# EAGLE design bp_to_avr (EAGLE 6.3)
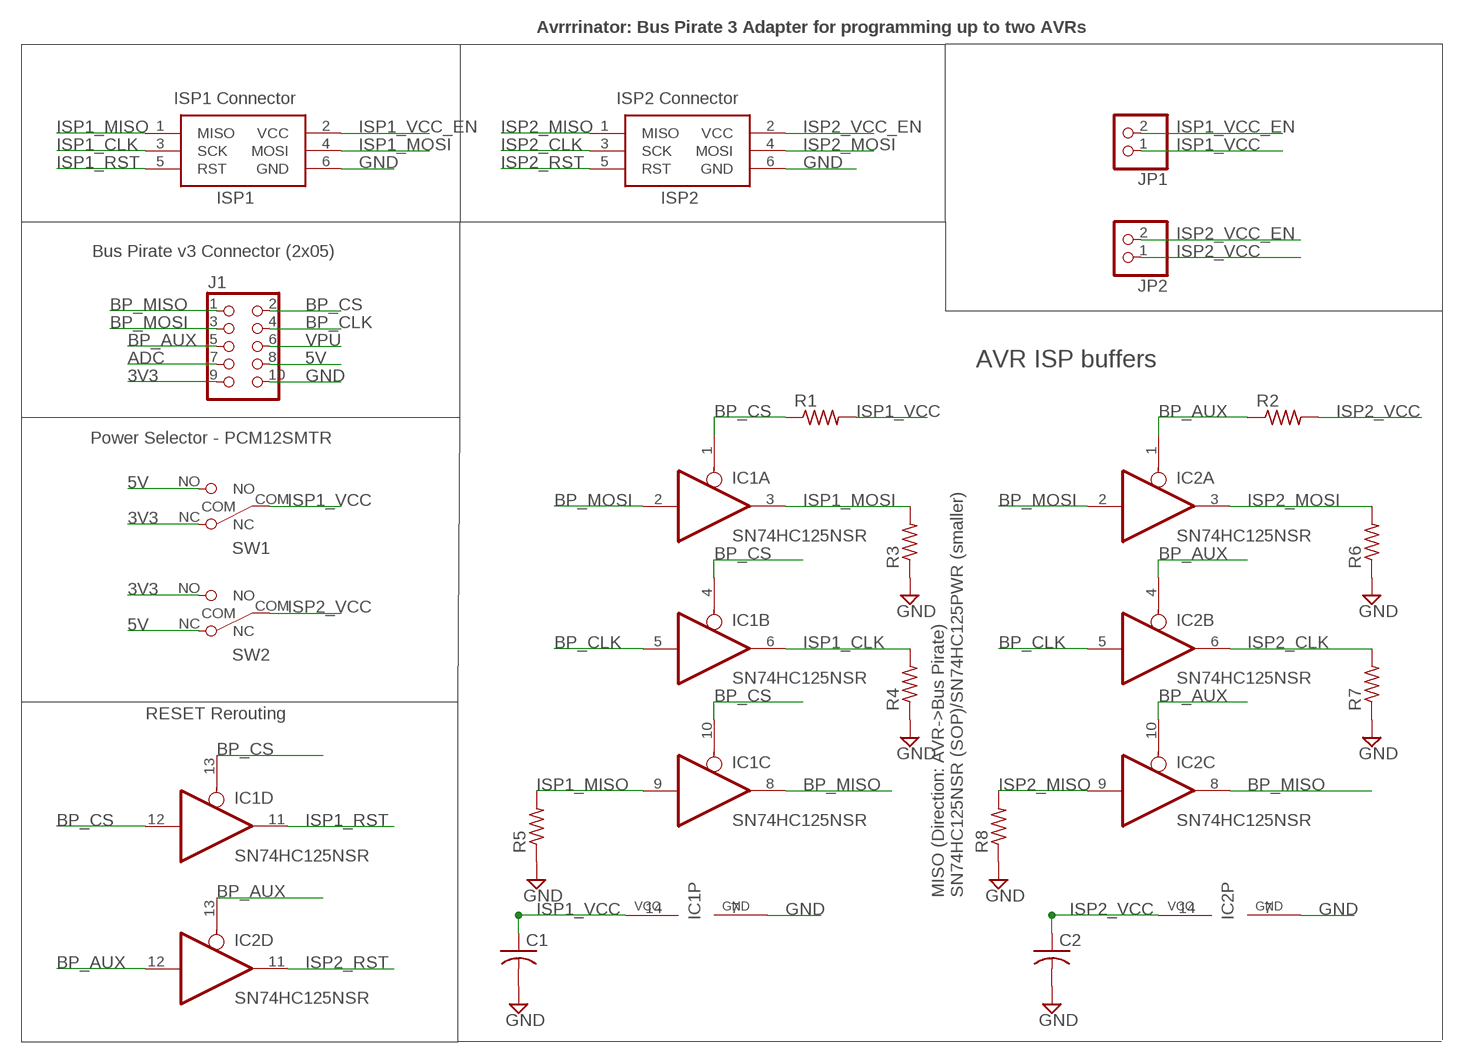
[diagram p0: schematic, sheet 1]

## Parts
C1  C-USC0603  [C0603]
C2  C-USC0603  [C0603]
IC1  SN74HC125NSR  AVRRRINATOR_74125PWR  [AVRRRINATOR-PWR]
IC2  SN74HC125NSR  AVRRRINATOR_74125PWR  [AVRRRINATOR-PWR]
ISP1  AVRRRINATOR-AVRISP-6PIN-6  [AVRRRINATOR-AVRISP-6PIN]
ISP2  AVRRRINATOR-AVRISP-6PIN-6  [AVRRRINATOR-AVRISP-6PIN]
J1  CON_HEADER_2X05-PTH+SHROUDED_B  [PINSHRD_PTH_2X05B]
JP1  HEADER-1X2ROUND  [1X02_ROUND]
JP2  HEADER-1X2ROUND  [1X02_ROUND]
R1  R-US_R0603  [R0603]
R2  R-US_R0603  [R0603]
R3  R-US_R0603  [R0603]
R4  R-US_R0603  [R0603]
R5  R-US_R0603  [R0603]
R6  R-US_R0603  [R0603]
R7  R-US_R0603  [R0603]
R8  R-US_R0603  [R0603]
SW1  SW_SLIDE  [SLIDE_SWITCH_SMD]
SW2  SW_SLIDE  [SLIDE_SWITCH_SMD]

## Nets
3V3: J1.9 SW1.NC SW2.NO
5V: J1.8 SW1.NO SW2.NC
ADC: J1.7
BP_AUX: IC2.1(A:OE) IC2.4(B:OE) IC2.10(C:OE) IC2.12(D:I) IC2.13(D:OE) J1.5 R2.1
BP_CLK: IC1.5(B:I) IC2.5(B:I) J1.4
BP_CS: IC1.1(A:OE) IC1.4(B:OE) IC1.10(C:OE) IC1.12(D:I) IC1.13(D:OE) J1.2 R1.1
BP_MISO: IC1.8(C:O) IC2.8(C:O) J1.1
BP_MOSI: IC1.2(A:I) IC2.2(A:I) J1.3
GND: C1.2 C2.2 IC1.7(P:GND) IC2.7(P:GND) ISP1.6(GND) ISP2.6(GND) J1.10 R3.1 R4.1 R5.1 R6.1 R7.1 R8.1
ISP1_CLK: IC1.6(B:O) ISP1.3(SCK) R4.2
ISP1_MISO: IC1.9(C:I) ISP1.1(MISO) R5.2
ISP1_MOSI: IC1.3(A:O) ISP1.4(MOSI) R3.2
ISP1_RST: IC1.11(D:O) ISP1.5(RST)
ISP1_VCC: C1.1 IC1.14(P:VCC) JP1.1 R1.2 SW1.COM
ISP1_VCC_EN: ISP1.2(VCC) JP1.2
ISP2_CLK: IC2.6(B:O) ISP2.3(SCK) R7.2
ISP2_MISO: IC2.9(C:I) ISP2.1(MISO) R8.2
ISP2_MOSI: IC2.3(A:O) ISP2.4(MOSI) R6.2
ISP2_RST: IC2.11(D:O) ISP2.5(RST)
ISP2_VCC: C2.1 IC2.14(P:VCC) JP2.1 R2.2 SW2.COM
ISP2_VCC_EN: ISP2.2(VCC) JP2.2
VPU: J1.6

## Notes on the sheet
- Avrrrinator: Bus Pirate 3 Adapter for programming up to two AVRs
- ISP1 Connector | ISP2 Connector
- Bus Pirate v3 Connector (2x05)
- AVR ISP buffers
- Power Selector - PCM12SMTR
- RESET Rerouting
- MISO (Direction: AVR->Bus Pirate)
  SN74HC125NSR (SOP)/SN74HC125PWR (smaller)

## Library data of the parts
C1 C2 = adafruit:C-US: CAPACITOR, American symbol
IC1 IC2 = avrrrinator:AVRRRINATOR_74*125: Quad bus BUFFER, 3-state This library contains TI-based parts PWR (very small SOP) and NSR (larger SOP). Full part numbers are: SN74HC125PWR SN74HC125NSR
ISP1 ISP2 = avrrrinator:AVRRRINATOR-AVRISP-6PIN: AVR ISP HEADER Standard 6 pin header for AVR programming. Derived from the Adafruit 6-pin ISP device layout.
J1 = dp_devices:CON_HEADER_2X05: 2x05 pin header
JP1 JP2 = microbuilder:HEADER-1X2: PIN HEADER
R1-R8 = adafruit:R-US_: RESISTOR, American symbol
SW1 SW2 = dp_devices:SW_SLIDE

## Board
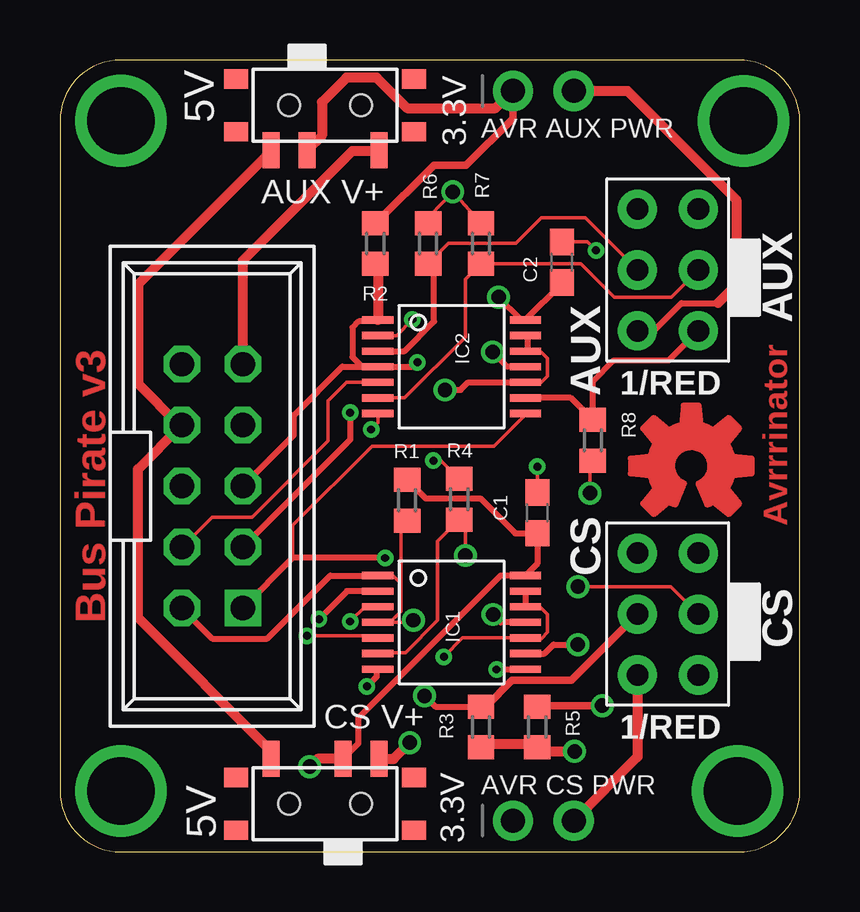
[diagram p1: board, top side]
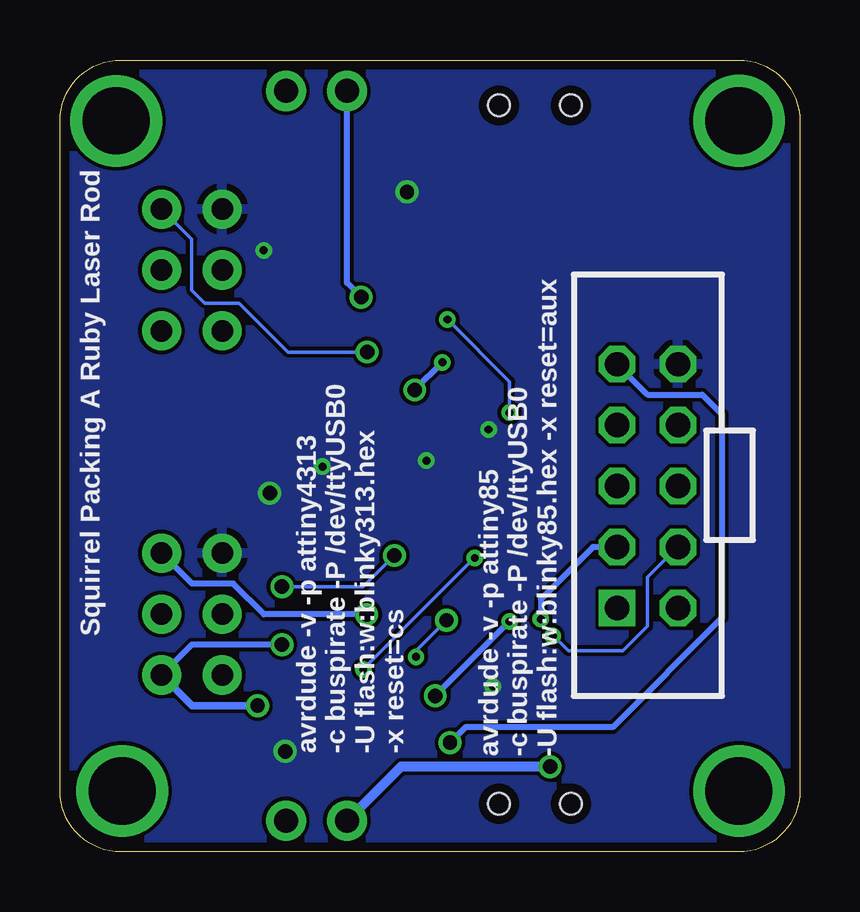
[diagram p2: board, bottom side, seen from below]

Size 30.84 x 32.99 mm. Coordinates in mm from the lower left corner, seen from the top.
Outline: 2.54,0 28.3,0 arc90 30.84,2.54 30.84,30.45 arc90 28.3,32.99 2.54,32.99 arc90 0,30.45 0,2.54 arc90 2.54,0
Copper layers (1*16): Top 0.0356mm / dielectric 1.5011mm / Bottom 0.0356mm
Design rules "default": minimum track width 6mil, minimum drill 13mil, track to track 6mil, track to pad 6mil, pad to pad 6mil, via to via 6mil, smd to smd 6mil, copper to edge 15mil, drill to drill 6mil, minimum pad ring 7mil, minimum via ring 7mil, stop-mask expansion 4mil, vias tented up to drill 30mil, thermal gap 10mil

### Footprints (pad centres in the part's own frame; a part is rotated, then mirrored left to right if it is on the bottom)
C0603 = smd 1.1 x 1: 1 -0.85,0; 2 0.85,0
AVRRRINATOR-PWR = smd 0.3 x 1.304: 1 -1.95,-3.275; 2 -1.3,-3.275; 3 -0.65,-3.275; 4 0,-3.275; 5 0.65,-3.275; 6 1.3,-3.275; 7 1.95,-3.275; 8 1.95,2.875; 9 1.3,2.875; 10 0.65,2.875; 11 0,2.875; 12 -0.65,2.875; 13 -1.3,2.875; 14 -1.95,2.875
AVRRRINATOR-AVRISP-6PIN = drill 0.9 pad 1.626: 1 -1.27,2.54; 2 1.27,2.54; 3 -1.27,0; 4 1.27,0; 5 -1.27,-2.54; 6 1.27,-2.54
PINSHRD_PTH_2X05B = drill 1.016 square: 1 -5.08,-1.27 | drill 1.016 octagon: 2 -5.08,1.27; 3 -2.54,-1.27; 4 -2.54,1.27; 5 0,-1.27; 6 0,1.27; 7 2.54,-1.27; 8 2.54,1.27; 9 5.08,-1.27; 10 5.08,1.27
1X02_ROUND = drill 1 pad 1.676: 1 -1.27,0; 2 1.27,0
R0603 = smd 1 x 1.1: 1 -0.85,0; 2 0.85,0
SLIDE_SWITCH_SMD = smd 0.7 x 1.5: COM 0.75,1.875; NC 2.25,1.875; NO -2.25,1.875 | smd 1 x 0.8: P$1 -3.7,-1.1; P$2 -3.7,1.1; P$3 3.7,1.1; P$4 3.7,-1.1 | hole 0.9: -1.5,0; 1.5,0

### Placement (x,y rotation side)
C1  19.9,14.12 90 top
C2  20.92,24.57 90 top
IC1  16.53,9.56 270 top
IC2  16.53,20.21 270 top
ISP1  25.34,9.91 180 top
ISP2  25.34,24.25 180 top
J1  6.35,15.24 90 top
JP1  20.15,1.3 0 top
JP2  20.15,31.71 0 top
R1  14.47,14.66 90 top
R2  13.15,25.35 90 top
R3  17.55,5.2 90 top
R4  16.65,14.7 270 top
R5  19.9,5.2 90 top
R6  15.35,25.35 270 top
R7  17.55,25.35 270 top
R8  22.21,17.15 90 top
SW1  11.05,2 0 top
SW2  11.05,31.1 180 top
U$1  [ADAFRUIT_OSHWLOGO_TOP_0.2_NO_MASK]  26.32,16.08 0 top

### Tracks (layer width: path | path; a pad name or v marks a point on that pad's centre or on a via)
3V3  (via drill 0.6)
  Top 0.152: 13.3,29.2 SW2.NO
  Top 0.406: 13.3,29.2 12.18,29.2 7.62,24.64 J1.9 | SW1.NC 13.91,3.88 v14.58,4.55
  Bottom 0.254: J1.9 6.35,19.05 4.06,19.05 3.25,18.24 3.25,9.75 7.8,5.2 13.93,5.2 v14.58,4.55
5V
  Top 0.152: 8.8,29.2 SW2.NC
  Top 0.254: SW1.NO 8.8,4.2 | 4.97,17.78 J1.8
  Top 0.406: 8.8,4.2 3.25,9.75 3.25,15.95 J1.8 | 8.8,29.2 3.25,23.65 3.25,19.5 4.97,17.78
BP_AUX  (via drill 0.33, 0.6)
  Top 0.152: 19.5,20.9 IC2.12 19.44,20.83 20.07,20.83 20.32,20.57 20.32,19.81 20.07,19.57 IC2.10 | 19.5,21.5 IC2.13 | 13.3,22.1 IC2.1 13.2,22.1
  Top 0.254: 19.5,21.5 19.5,21 IC2.12 | IC2.4 12.6,20.21 12.19,20.62 12.19,21.84 12.45,22.1 13.3,22.1 | IC2.4 14.71,20.21 v14.9,20.4 | 13.53,22.16 IC2.1 | v16.05,19.25 16.71,19.25 17.02,19.56 19.4,19.56 IC2.10 | J1.5 9.75,17.37 9.75,18.2 11.77,20.21 IC2.4
  Top 0.406: R2.1 13.26,24.5 IC2.1
  Bottom 0.254: v14.9,20.4 v16.05,19.25
BP_CLK  (via drill 0.33)
  Top 0.152: v10.3,9 13.2,9 IC1.5 | 13.2,19.5 IC2.5 11.95,19.57 11.18,18.8 11.18,17.12 8,13.95 6.35,13.95 5.1,12.7 J1.4
  Bottom 0.152: J1.4 5.1,12.7 6.35,11.45 6.35,9.4 7.37,8.38 9.65,8.38 10.27,9 v10.3,9
BP_CS  (via drill 0.33, 0.6)
  Top 0.152: 19.4,10.3 IC1.12 20.01,10.21 20.32,9.91 20.32,9.14 20.07,8.89 19.38,8.89 | 13.2,11.5 IC1.1 13.88,11.52 14.22,11.18 | 14.22,11.18 14.22,10.02 13.77,9.56 IC1.4 14.64,9.56 v14.73,9.65 | IC1.10 16.79,8.91 v16,8.13 | R1.1 14.22,13.4 14.22,11.18
  Top 0.254: 19.38,8.89 IC1.10 | IC1.12 IC1.13 | IC1.1 11.26,11.52 8.64,8.89 6.35,8.89 J1.2
  Bottom 0.152: v16,8.13 16,8.38 v14.73,9.65
BP_MISO  (via drill 0.33)
  Top 0.152: IC1.8 | 9.71,12.25 9.71,13.61 13,16.9 18.1,16.9 19.41,18.2 IC2.8
  Top 0.254: v18.2,7.6 IC1.8 | v13.55,12.25 9.71,12.25 J1.1
  Bottom 0.152: v13.55,12.25 v18.2,7.6
BP_MOSI  (via drill 0.33)
  Top 0.152: IC2.2 14.02,21.52 v14.69,22.18
  Top 0.254: v12.1,18.3 12.1,17.18 J1.3 | IC1.2 11.96,10.87 v10.8,9.7
  Bottom 0.152: v12.1,18.3 12.1,19.59 v14.69,22.18
  Bottom 0.254: J1.3 8.64,12.7 10.8,10.54 v10.8,9.7
GND  (via drill 0.33, 0.6)
  Top 0.152: v19.9,16.05 C1.2 | 13.2,7.6 IC1.7 | 17.71,4.51 R3.1 17.55,4.19 | v12.97,17.6 13.26,17.88 IC2.7 | v15.57,16.3 15.89,16.3 R4.1 | v22.35,25.06 22,25.42 C2.2 | R7.1 v16.38,27.5 14.95,26 R6.1 | 19.67,4.35 R5.1 | 22.1,16.19 v22.1,14.95
  Top 0.254: 13.2,7.6 13.2,7.3 v12.8,6.9 | R4.1 16.3,15.55
  Top 0.406: R8.1 22.1,16.19 | 17.71,4.51 19.9,4.51 R5.1 20.06,4.19 v21.45,4.19
  pour Bottom: 0,33.15 0,0 31.2,0 31.2,33.15
ISP1_CLK  (via drill 0.6)
  Top 0.152: IC1.6 13.3,8.3 14.4,8.3 15.75,9.65 15.75,12.95 R4.2 16.9,13.59 v16.9,12.35 | v21.59,11.05 25.48,11.05 ISP1.3
  Bottom 0.152: v16.9,12.35 18.2,11.05 v21.59,11.05
ISP1_MISO  (via drill 0.6)
  Top 0.152: R5.2 19.94,6.1
  Top 0.254: IC1.9 20.2,8.27 20.57,8.64 v21.59,8.64
  Top 0.305: 19.94,6.1 v22.61,6.1
  Bottom 0.254: v21.59,8.64 25.35,8.64 ISP1.1
  Bottom 0.305: v22.61,6.1 25.34,6.1 ISP1.1
ISP1_MOSI  (via drill 0.33, 0.6)
  Top 0.152: IC1.3 12.71,10.21 v12.1,9.6 | R3.2 17.75,6.05
  Top 0.254: v15.2,6.5 15.65,6.05 R3.2
  Top 0.305: 17.75,6.05 18.85,7.15 21.32,7.15 ISP1.4
  Bottom 0.254: v15.2,6.5 v12.1,9.6
ISP1_RST  (via drill 0.6)
  Top 0.254: IC1.11 18.39,9.56 v18.06,9.89
  Bottom 0.254: v18.06,9.89 22.34,9.89 23.62,11.18 25.34,11.18 ISP1.5
ISP1_VCC  (via drill 0.6)
  Top 0.254: SW1.COM 12.45,4.52 12.45,5.59 18.37,11.52 IC1.14 19.9,12.01 C1.1 18.98,13.28 17.53,14.73 15.25,14.73 R1.2
  Top 0.406: SW1.COM 10.73,3.88 v10.41,3.56
  Bottom 0.406: v10.41,3.56 16.62,3.56 JP1.1
ISP1_VCC_EN
  Top 0.406: ISP1.2 24.07,3.96 JP1.2
ISP2_CLK
  Top 0.152: IC2.6 14.37,18.91 16.9,21.45 16.9,23.85 R7.2 21.73,24.5 23.11,23.11 25.48,23.11 ISP2.3
ISP2_MISO
  Top 0.254: IC2.9 21.3,18.91 R8.2 22.21,19.61 23.07,20.48 25.39,20.48 ISP2.1
ISP2_MOSI
  Top 0.152: R6.2 16.2,25.35 19,25.35 20.07,26.42 21.9,26.42 ISP2.4
  Top 0.254: IC2.3 14.37,20.86 15.6,22.1 15.6,24.25 R6.2
ISP2_RST  (via drill 0.6)
  Top 0.254: IC2.11 18.65,20.21 v18.03,20.83
  Bottom 0.152: v18.03,20.83 21.34,20.83 23.37,22.86 24.81,22.86 25.35,23.4 25.35,25.52 ISP2.5
ISP2_VCC  (via drill 0.6)
  Top 0.152: C2.1 20.92,23.68
  Top 0.254: v18.29,23.11 19.24,22.16 IC2.14 20.92,23.68
  Top 0.305: R2.2 15.6,28.6 16.93,28.6 18.88,30.55 JP2.1
  Top 0.406: SW2.COM 10.92,29.85 10.92,31.24 11.94,32.26 13.21,32.26 14.48,30.99 18.16,30.99 JP2.1
  Bottom 0.254: v18.29,23.11 18.88,23.71 JP2.1
ISP2_VCC_EN
  Top 0.254: 27.43,22.86 25.91,22.86 24.75,21.7 ISP2.2
  Top 0.406: JP2.2 23.66,31.71 28.19,27.18 28.19,23.62 27.43,22.86
N$1  (via drill 2.8 pad 0.3)
  other vias: 2.54,30.46
N$2  (via drill 2.8 pad 0.3)
  other vias: 2.54,2.54
N$3  (via drill 2.8 pad 0.3)
  other vias: 28.5,30.46
N$4  (via drill 2.8 pad 0.3)
  other vias: 28.25,2.54

### Text on the board
Top: Avrrrinator | Bus Pirate v3
tStop: Avrrrinator | Bus Pirate v3
bStop: Rev B | open.konspyre.org/avrb | 3/3/2014
_tsilk: 5V | AVR AUX PWR | 3.3V | AUX V+ | AUX | AUX | CS | CS | CS V+ | 5V | AVR CS PWR | 3.3V
_bsilk: Squirrel Packing A Ruby Laser Rod | avrdude -v -p attiny85 / -c buspirate -P /dev/ttyUSB0 / -U flash:w:blinky85.hex -x reset=aux | avrdude -v -p attiny4313 / -c buspirate -P /dev/ttyUSB0 / -U flash:w:blinky313.hex / -x reset=cs